# EAGLE schematic host (EAGLE 9.6.2)

## Sheet 1 of 4
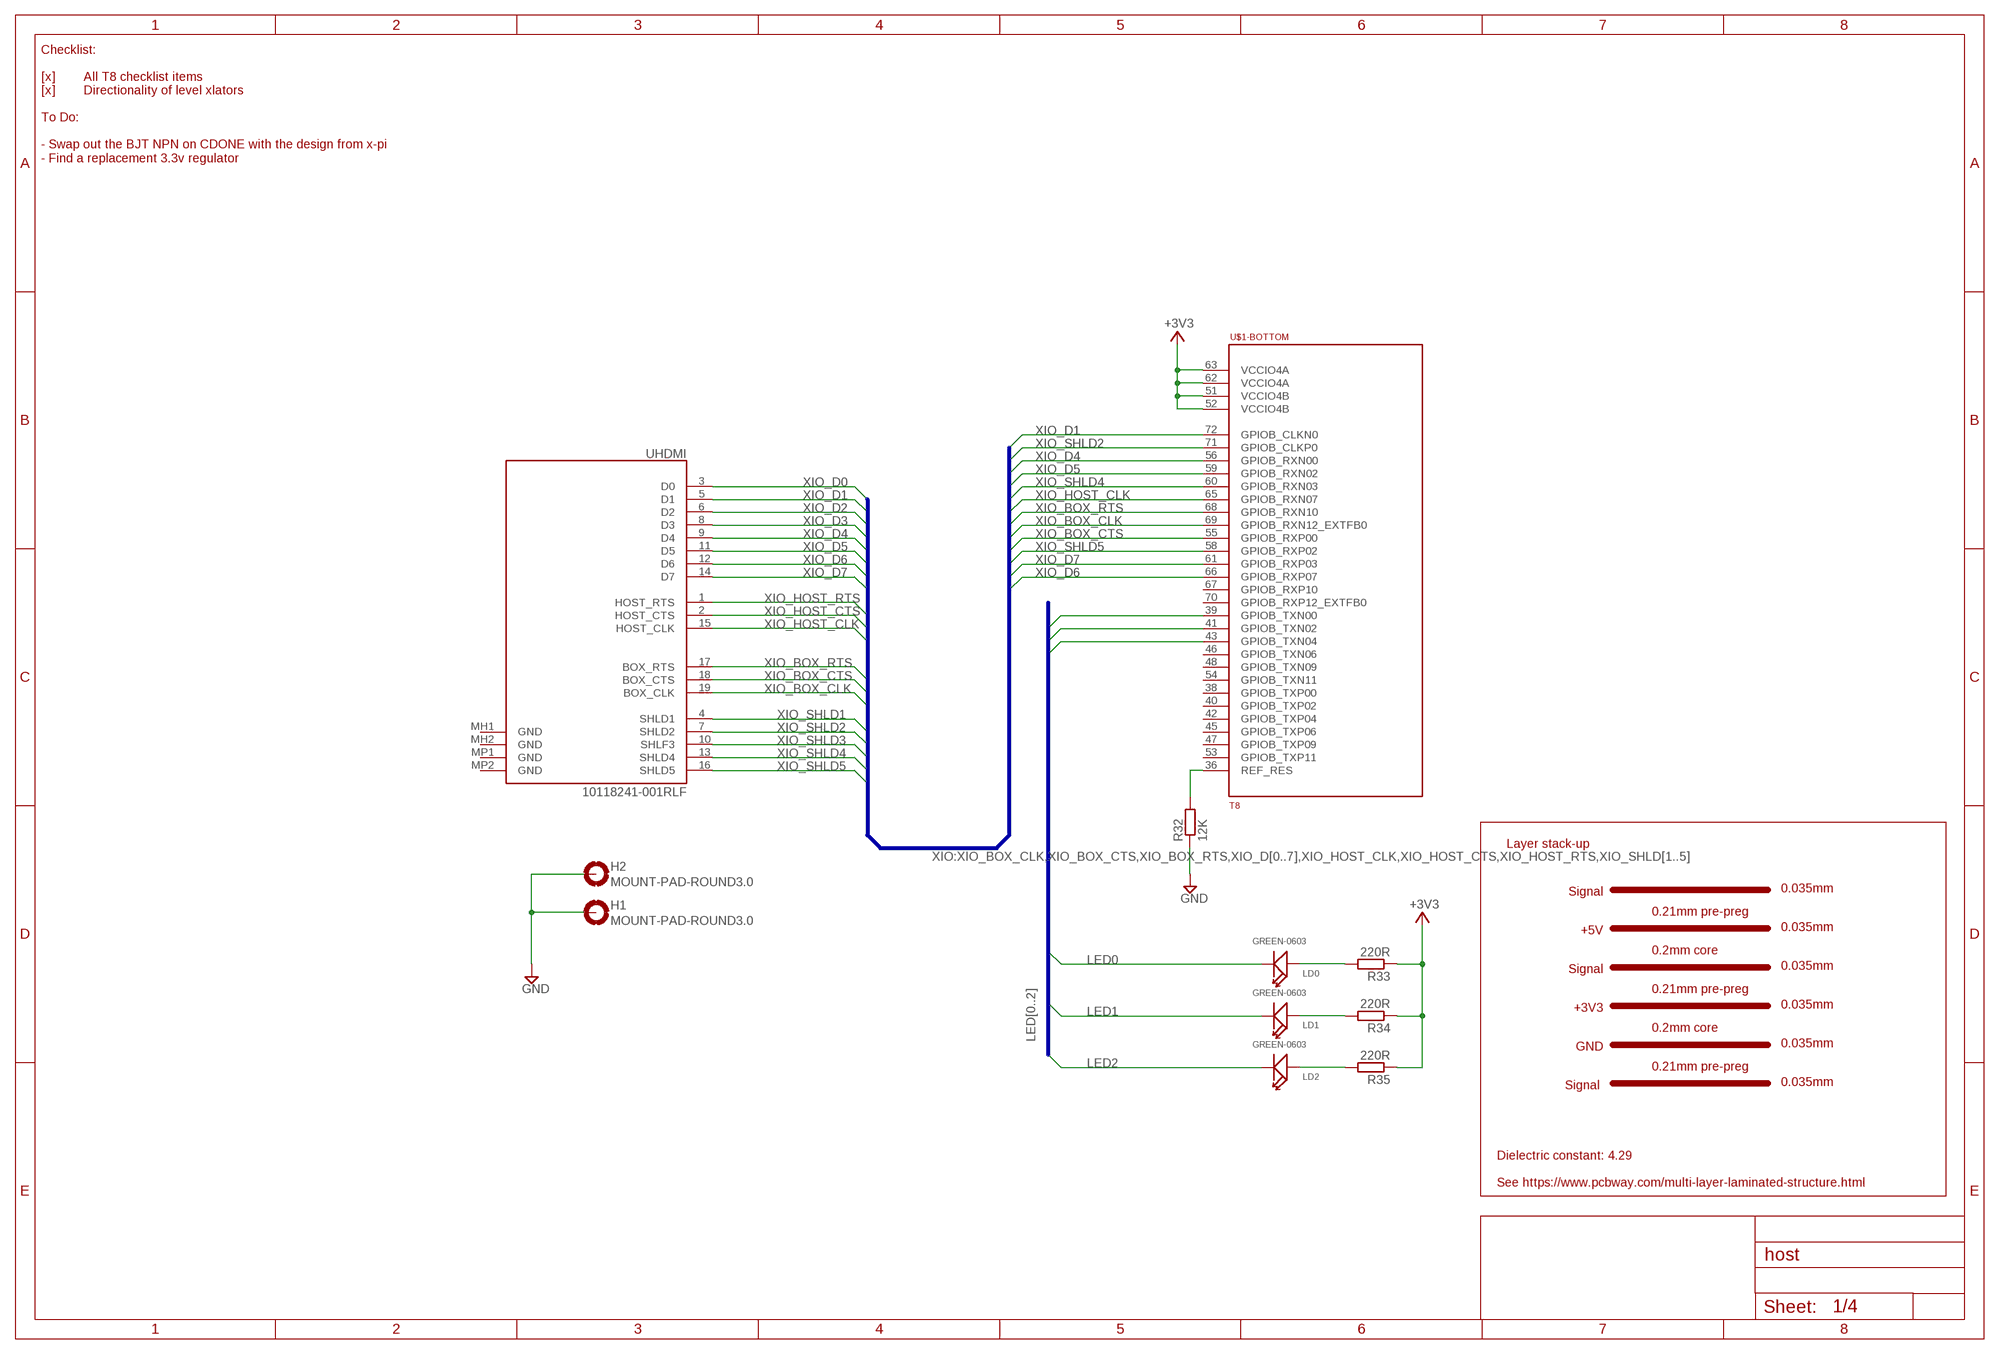
[diagram p0: schematic, sheet 1]

### Parts
H1  MOUNT-PAD-ROUND3.0  [3,0-PAD]
H2  MOUNT-PAD-ROUND3.0  [3,0-PAD]
LD0  GREEN-0603  SMD-LED-CLEAR-GREEN(0603)  [LED-0603]
LD1  GREEN-0603  SMD-LED-CLEAR-GREEN(0603)  [LED-0603]
LD2  GREEN-0603  SMD-LED-CLEAR-GREEN(0603)  [LED-0603]
R32  12K  R-EU_R0201  [R0201]
R33  220R  R-EU_R0201  [R0201]
R34  220R  R-EU_R0201  [R0201]
R35  220R  R-EU_R0201  [R0201]
U$1  T8  [TQFP144]
UHDMI  10118241-001RLF  [10118241001RLF]

### Nets
+3V3: R33.1 R34.1 R35.1 U$1.51(-BOTTOM:VCCIO4B) U$1.52(-BOTTOM:VCCIO4B) U$1.62(-BOTTOM:VCCIO4A) U$1.63(-BOTTOM:VCCIO4A) ; also sheet 2,3,4
GND: H1.B3,0(MOUNT) H2.B3,0(MOUNT) R32.1 ; also sheet 2,3,4
LED0: LD0.- U$1.39(-BOTTOM:GPIOB_TXN00)
LED1: LD1.- U$1.41(-BOTTOM:GPIOB_TXN02)
LED2: LD2.- U$1.43(-BOTTOM:GPIOB_TXN04)
N$8: R32.2 U$1.36(-BOTTOM:REF_RES)
N$13: LD0.+ R33.2
N$15: LD1.+ R34.2
N$16: LD2.+ R35.2
XIO_BOX_CLK: U$1.69(-BOTTOM:GPIOB_RXN12_EXTFB0) UHDMI.19(BOX_CLK) ; also sheet 4
XIO_BOX_CTS: U$1.55(-BOTTOM:GPIOB_RXP00) UHDMI.18(BOX_CTS) ; also sheet 4
XIO_BOX_RTS: U$1.68(-BOTTOM:GPIOB_RXN10) UHDMI.17(BOX_RTS) ; also sheet 4
XIO_D0: UHDMI.3(D0) ; also sheet 4
XIO_D1: U$1.72(-BOTTOM:GPIOB_CLKN0) UHDMI.5(D1) ; also sheet 4
XIO_D2: UHDMI.6(D2) ; also sheet 4
XIO_D3: UHDMI.8(D3) ; also sheet 4
XIO_D4: U$1.56(-BOTTOM:GPIOB_RXN00) UHDMI.9(D4) ; also sheet 4
XIO_D5: U$1.59(-BOTTOM:GPIOB_RXN02) UHDMI.11(D5) ; also sheet 4
XIO_D6: U$1.66(-BOTTOM:GPIOB_RXP07) UHDMI.12(D6) ; also sheet 4
XIO_D7: U$1.61(-BOTTOM:GPIOB_RXP03) UHDMI.14(D7) ; also sheet 4
XIO_HOST_CLK: U$1.65(-BOTTOM:GPIOB_RXN07) UHDMI.15(HOST_CLK) ; also sheet 4
XIO_HOST_CTS: UHDMI.2(HOST_CTS) ; also sheet 4
XIO_HOST_RTS: UHDMI.1(HOST_RTS) ; also sheet 4
XIO_SHLD1: UHDMI.4(SHLD1) ; also sheet 4
XIO_SHLD2: U$1.71(-BOTTOM:GPIOB_CLKP0) UHDMI.7(SHLD2) ; also sheet 4
XIO_SHLD3: UHDMI.10(SHLF3) ; also sheet 4
XIO_SHLD4: U$1.60(-BOTTOM:GPIOB_RXN03) UHDMI.13(SHLD4) ; also sheet 4
XIO_SHLD5: U$1.58(-BOTTOM:GPIOB_RXP02) UHDMI.16(SHLD5) ; also sheet 4
Unconnected: U$1.38(-BOTTOM:GPIOB_TXP00) U$1.40(-BOTTOM:GPIOB_TXP02) U$1.42(-BOTTOM:GPIOB_TXP04) U$1.45(-BOTTOM:GPIOB_TXP06) U$1.46(-BOTTOM:GPIOB_TXN06) U$1.47(-BOTTOM:GPIOB_TXP09) U$1.48(-BOTTOM:GPIOB_TXN09) U$1.53(-BOTTOM:GPIOB_TXP11) U$1.54(-BOTTOM:GPIOB_TXN11) U$1.67(-BOTTOM:GPIOB_RXP10) U$1.70(-BOTTOM:GPIOB_RXP12_EXTFB0) UHDMI.MH1(GND) UHDMI.MH2(GND) UHDMI.MP1(GND) UHDMI.MP2(GND)

### Buses
XIO:XIO_BOX_CLK,XIO_BOX_CTS,XIO_BOX_RTS,XIO_D[0..7],XIO_HOST_CLK,XIO_HOST_CTS,XIO_HOST_RTS,XIO_SHLD[1..5]
LED[0..2]

### Notes on the sheet
- Checklist:
  
  [x]        All T8 checklist items
  [x]        Directionality of level xlators
  
  To Do:
  
  - Swap out the BJT NPN on CDONE with the design from x-pi
  - Find a replacement 3.3v regulator
- Layer stack-up
- Signal
- 0.035mm
- 0.21mm pre-preg
- +5V
- 0.035mm
- 0.2mm core
- Signal
- 0.035mm
- 0.21mm pre-preg
- +3V3
- 0.035mm
- 0.2mm core
- GND
- 0.035mm
- 0.21mm pre-preg
- Signal
- 0.035mm
- Dielectric constant: 4.29
  
  See https://www.pcbway.com/multi-layer-laminated-structure.html

## Sheet 2 of 4: Power
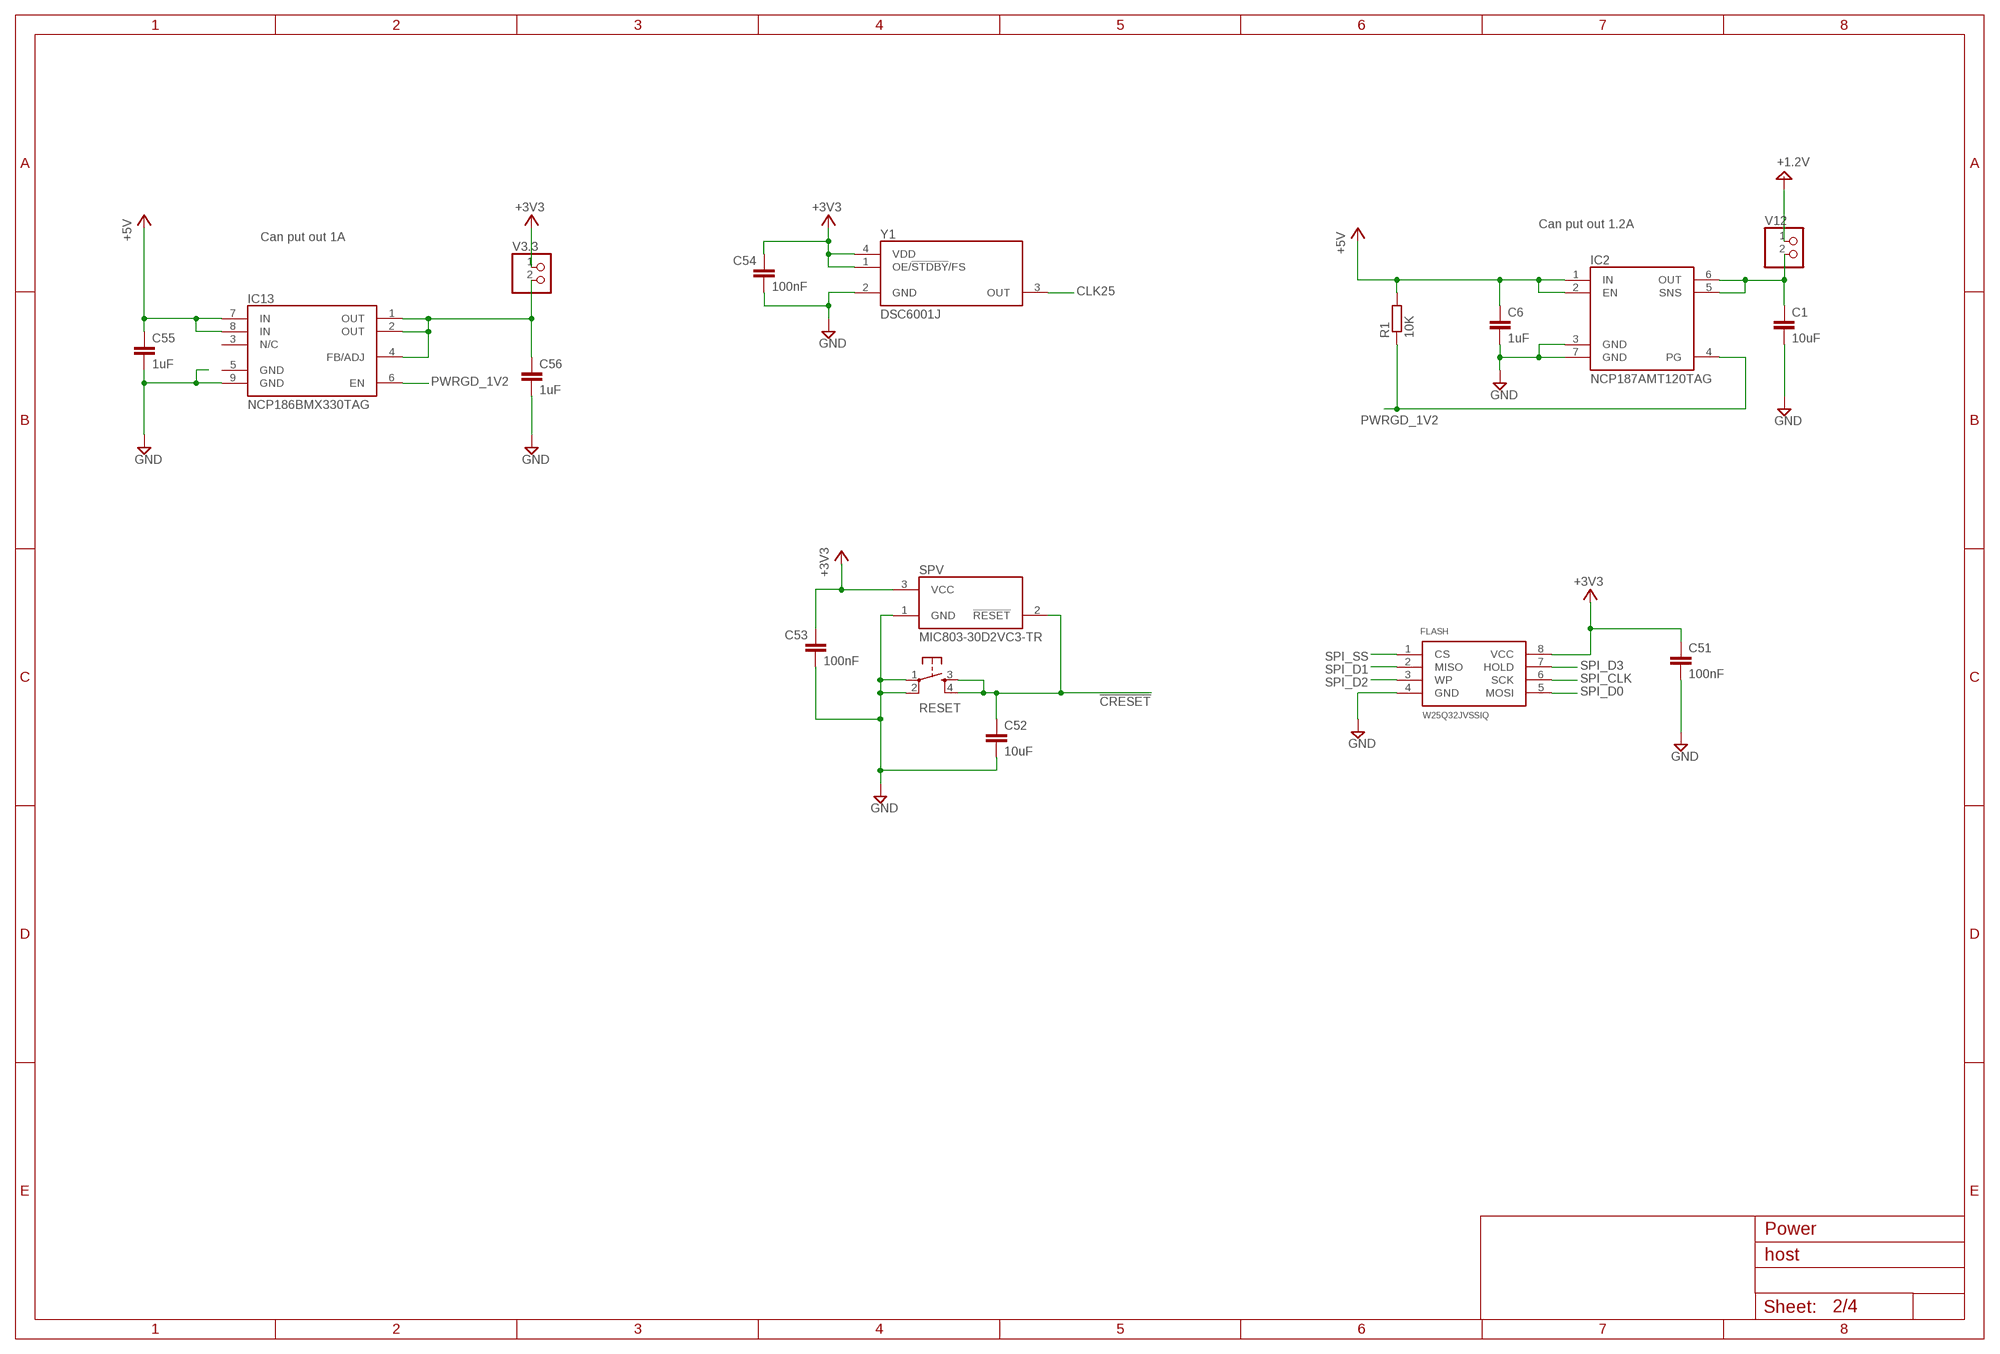
[diagram p1: schematic, sheet 2]

### Parts
C1  10uF  C-EUC0402K  [C0402K]
C6  1uF  C-EUC0201  [C0201]
C51  100nF  C-EUC0201  [C0201]
C52  10uF  C-EUC0402K  [C0402K]
C53  100nF  C-EUC0201  [C0201]
C54  100nF  C-EUC0201  [C0201]
C55  1uF  C-EUC0201  [C0201]
C56  1uF  C-EUC0201  [C0201]
FLASH  W25Q32JVSSIQ  SPI_FLASH-X25XXSMD  [SO08]
IC2  NCP187AMT120TAG  NCP187AMT330TAG  [SON65P200X200X80-7N]
IC13  NCP186BMX330TAG  [NCP186AMX330TAG]
R1  10K  R-EU_R0201  [R0201]
RESET  TAC_SWITCHPTH  [TACTILE-PTH]
SPV  MIC803-30D2VC3-TR  MIC803-30D2VM3-TR  [SOT95P237X111-3N]
V3.3  PINHD-1X2  [1X02]
V12  PINHD-1X2  [1X02]
Y1  DSC6001J  [DSC6001JE2B0240000]

### Nets
!CRESET!: C52.1 RESET.3 RESET.4 SPV.2(!RESET!) ; also sheet 3
+1.2V [+1.2v]: V12.1 ; also sheet 3,4
+3V3: C51.1 C53.1 C54.1 FLASH.8(VCC) SPV.3(VCC) V3.3.1 Y1.1(OE/!STDBY!/FS) Y1.4(VDD) ; also sheet 1,3,4
+5V: C6.1 C55.1 IC2.1(IN) IC2.2(EN) IC13.7(IN) IC13.8(IN) R1.2 ; also sheet 4
CLK25: Y1.3(OUT) ; also sheet 4
GND: C1.2 C6.2 C51.2 C52.2 C53.2 C54.2 C55.2 C56.2 FLASH.4(GND) IC2.3(GND) IC2.7(GND) IC13.9(GND) RESET.1 RESET.2 SPV.1(GND) Y1.2(GND) ; also sheet 1,3,4
N$2: C1.1 IC2.5(SNS) IC2.6(OUT) V12.2
N$18: C56.1 IC13.1(OUT) IC13.2(OUT) IC13.4(FB/ADJ) V3.3.2
PWRGD_1V2: IC2.4(PG) IC13.6(EN) R1.1
SPI_CLK: FLASH.6(SCK) ; also sheet 3
SPI_D0: FLASH.5(MOSI) ; also sheet 3
SPI_D1: FLASH.2(MISO) ; also sheet 3
SPI_D2: FLASH.3(WP) ; also sheet 4
SPI_D3: FLASH.7(HOLD) ; also sheet 3,4
SPI_SS: FLASH.1(CS) ; also sheet 3
Unconnected: IC13.3(N/C) IC13.5(GND)

### Notes on the sheet
- Can put out 1.2A
- Can put out 1A
- Power

## Sheet 3 of 4: FPGA
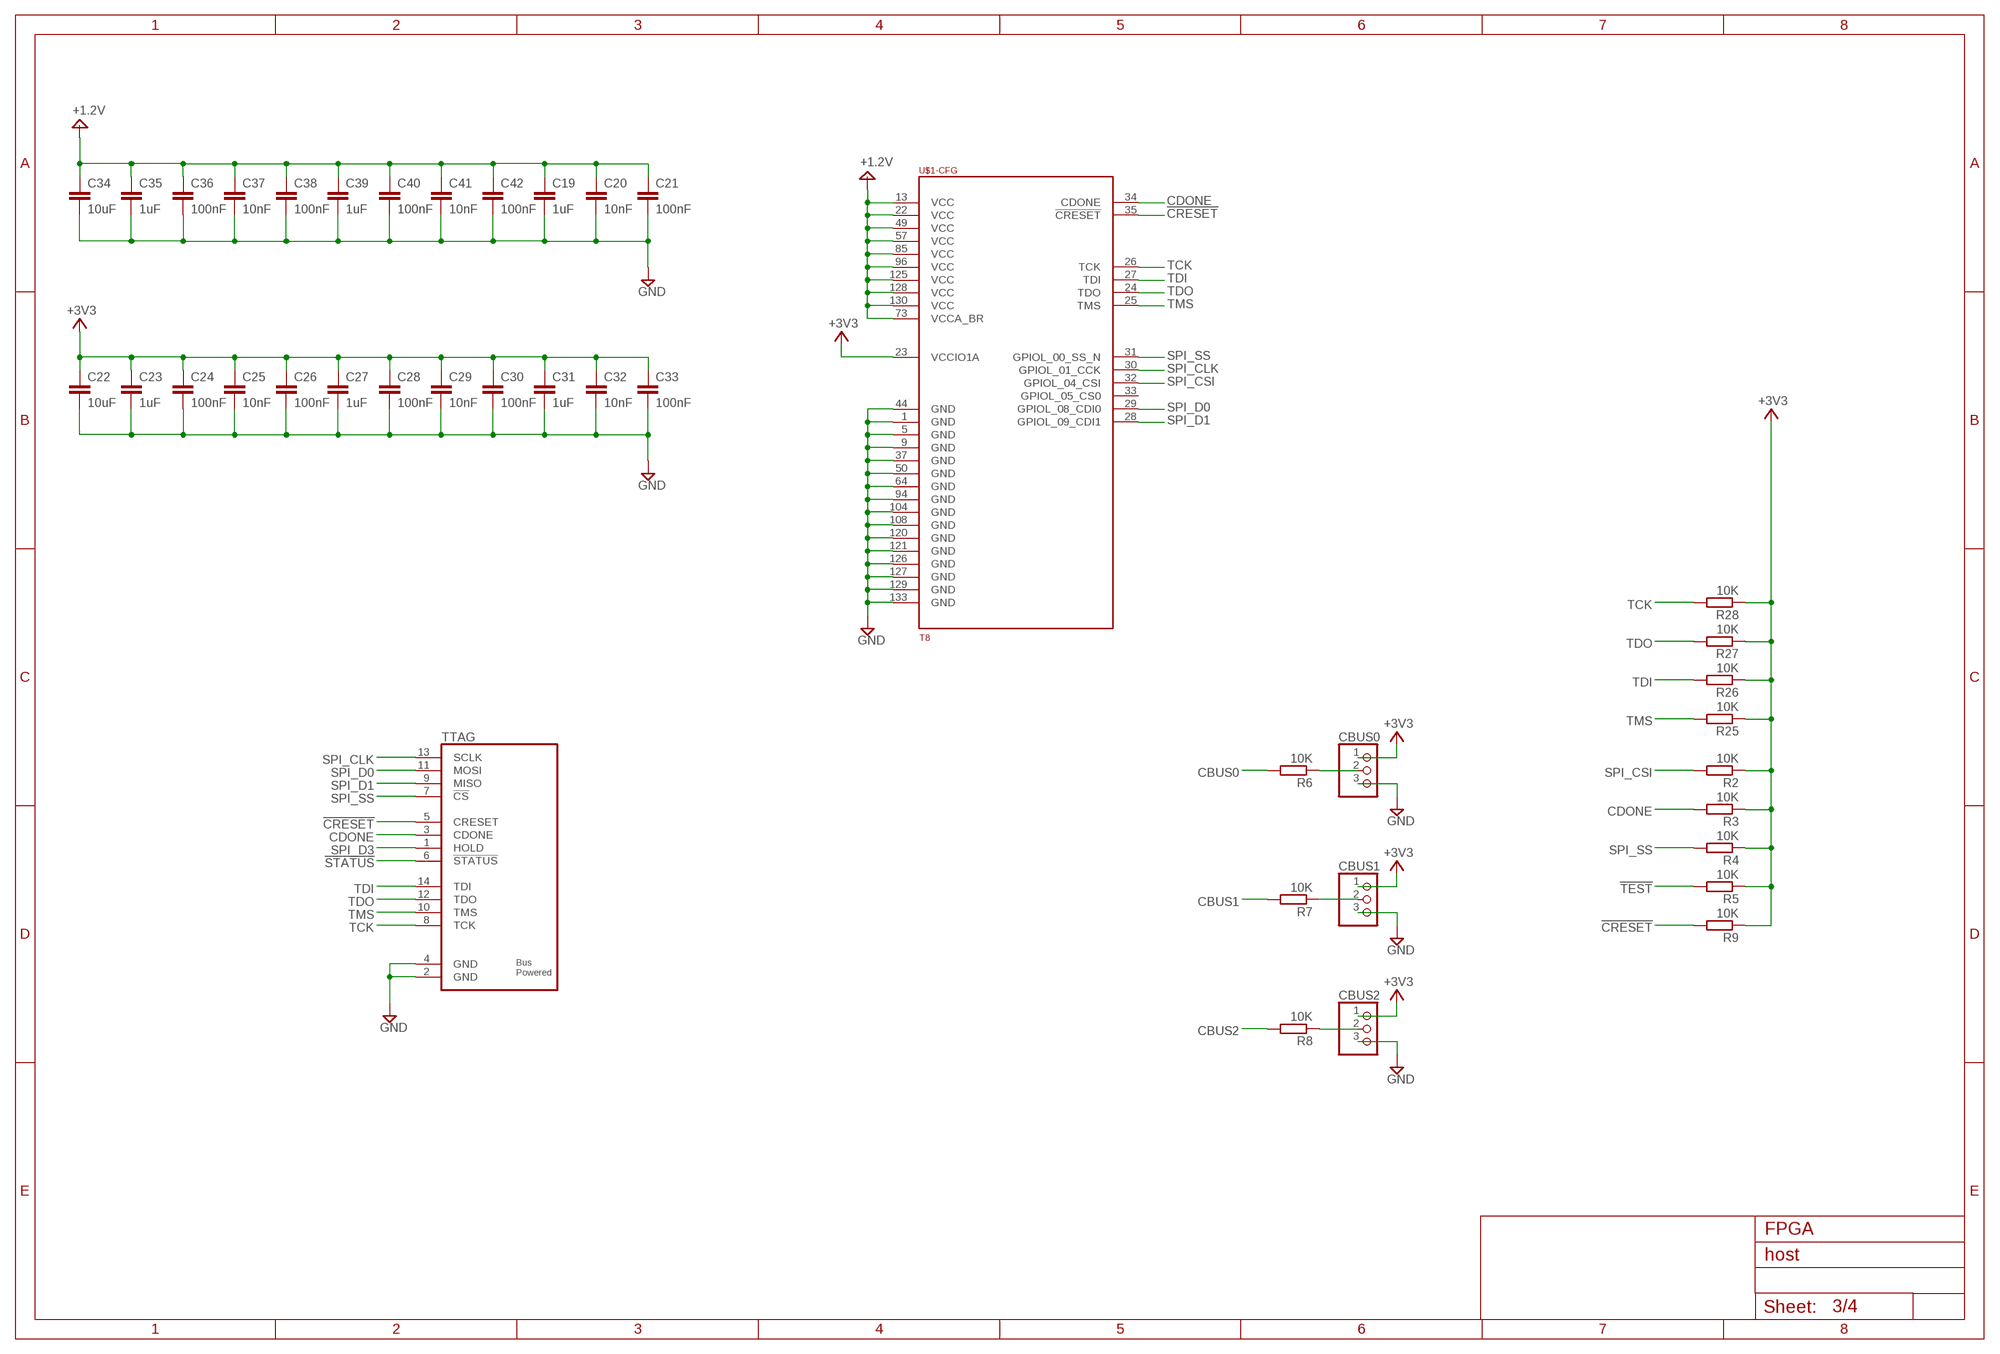
[diagram p2: schematic, sheet 3]

### Parts
C19  1uF  C-EUC0201  [C0201]
C20  10nF  C-EUC0201  [C0201]
C21  100nF  C-EUC0201  [C0201]
C22  10uF  C-EUC0402K  [C0402K]
C23  1uF  C-EUC0201  [C0201]
C24  100nF  C-EUC0201  [C0201]
C25  10nF  C-EUC0201  [C0201]
C26  100nF  C-EUC0201  [C0201]
C27  1uF  C-EUC0201  [C0201]
C28  100nF  C-EUC0201  [C0201]
C29  10nF  C-EUC0201  [C0201]
C30  100nF  C-EUC0201  [C0201]
C31  1uF  C-EUC0201  [C0201]
C32  10nF  C-EUC0201  [C0201]
C33  100nF  C-EUC0201  [C0201]
C34  10uF  C-EUC0402K  [C0402K]
C35  1uF  C-EUC0201  [C0201]
C36  100nF  C-EUC0201  [C0201]
C37  10nF  C-EUC0201  [C0201]
C38  100nF  C-EUC0201  [C0201]
C39  1uF  C-EUC0201  [C0201]
C40  100nF  C-EUC0201  [C0201]
C41  10nF  C-EUC0201  [C0201]
C42  100nF  C-EUC0201  [C0201]
CBUS0  PINHD-1X3  [1X03]
CBUS1  PINHD-1X3  [1X03]
CBUS2  PINHD-1X3  [1X03]
R2  10K  R-EU_R0201  [R0201]
R3  10K  R-EU_R0201  [R0201]
R4  10K  R-EU_R0201  [R0201]
R5  10K  R-EU_R0201  [R0201]
R6  10K  R-EU_R0201  [R0201]
R7  10K  R-EU_R0201  [R0201]
R8  10K  R-EU_R0201  [R0201]
R9  10K  R-EU_R0201  [R0201]
R25  10K  R-EU_R0201  [R0201]
R26  10K  R-EU_R0201  [R0201]
R27  10K  R-EU_R0201  [R0201]
R28  10K  R-EU_R0201  [R0201]
TTAG  TTAG_M_2.00  [2X07M]

### Nets
!CRESET!: R9.2 TTAG.5(CRESET) U$1.35(-CFG:!CRESET!) ; also sheet 2
!STATUS!: TTAG.6(!STATUS!) ; also sheet 4
!TEST!: R5.2 ; also sheet 4
+1.2V [+1.2v]: C19.1 C20.1 C21.1 C34.1 C35.1 C36.1 C37.1 C38.1 C39.1 C40.1 C41.1 C42.1 U$1.13(-CFG:VCC) U$1.22(-CFG:VCC) U$1.49(-CFG:VCC) U$1.57(-CFG:VCC) U$1.73(-CFG:VCCA_BR) U$1.85(-CFG:VCC) U$1.96(-CFG:VCC) U$1.125(-CFG:VCC) U$1.128(-CFG:VCC) U$1.130(-CFG:VCC) ; also sheet 2,4
+3V3: C22.1 C23.1 C24.1 C25.1 C26.1 C27.1 C28.1 C29.1 C30.1 C31.1 C32.1 C33.1 CBUS0.1 CBUS1.1 CBUS2.1 R2.1 R3.1 R4.1 R5.1 R9.1 R25.1 R26.1 R27.1 R28.1 U$1.23(-CFG:VCCIO1A) ; also sheet 1,2,4
CBUS0: R6.2 ; also sheet 4
CBUS1: R7.2 ; also sheet 4
CBUS2: R8.2 ; also sheet 4
CDONE: R3.2 TTAG.3(CDONE) U$1.34(-CFG:CDONE) ; also sheet 4
GND: C19.2 C20.2 C21.2 C22.2 C23.2 C24.2 C25.2 C26.2 C27.2 C28.2 C29.2 C30.2 C31.2 C32.2 C33.2 C34.2 C35.2 C36.2 C37.2 C38.2 C39.2 C40.2 C41.2 C42.2 CBUS0.3 CBUS1.3 CBUS2.3 TTAG.2(GND) TTAG.4(GND) U$1.1(-CFG:GND) U$1.5(-CFG:GND) U$1.9(-CFG:GND) U$1.37(-CFG:GND) U$1.44(-CFG:GND) U$1.50(-CFG:GND) U$1.64(-CFG:GND) U$1.94(-CFG:GND) U$1.104(-CFG:GND) U$1.108(-CFG:GND) U$1.120(-CFG:GND) U$1.121(-CFG:GND) U$1.126(-CFG:GND) U$1.127(-CFG:GND) U$1.129(-CFG:GND) U$1.133(-CFG:GND) ; also sheet 1,2,4
N$10: CBUS0.2 R6.1
N$11: CBUS1.2 R7.1
N$12: CBUS2.2 R8.1
SPI_CLK: TTAG.13(SCLK) U$1.30(-CFG:GPIOL_01_CCK) ; also sheet 2
SPI_CSI: R2.2 U$1.32(-CFG:GPIOL_04_CSI)
SPI_D0: TTAG.11(MOSI) U$1.29(-CFG:GPIOL_08_CDI0) ; also sheet 2
SPI_D1: TTAG.9(MISO) U$1.28(-CFG:GPIOL_09_CDI1) ; also sheet 2
SPI_D3: TTAG.1(HOLD) ; also sheet 2,4
SPI_SS: R4.2 TTAG.7(!CS!) U$1.31(-CFG:GPIOL_00_SS_N) ; also sheet 2
TCK: R28.2 TTAG.8(TCK) U$1.26(-CFG:TCK)
TDI: R26.2 TTAG.14(TDI) U$1.27(-CFG:TDI)
TDO: R27.2 TTAG.12(TDO) U$1.24(-CFG:TDO)
TMS: R25.2 TTAG.10(TMS) U$1.25(-CFG:TMS)
Unconnected: U$1.33(-CFG:GPIOL_05_CS0)

### Notes on the sheet
- FPGA

## Sheet 4 of 4
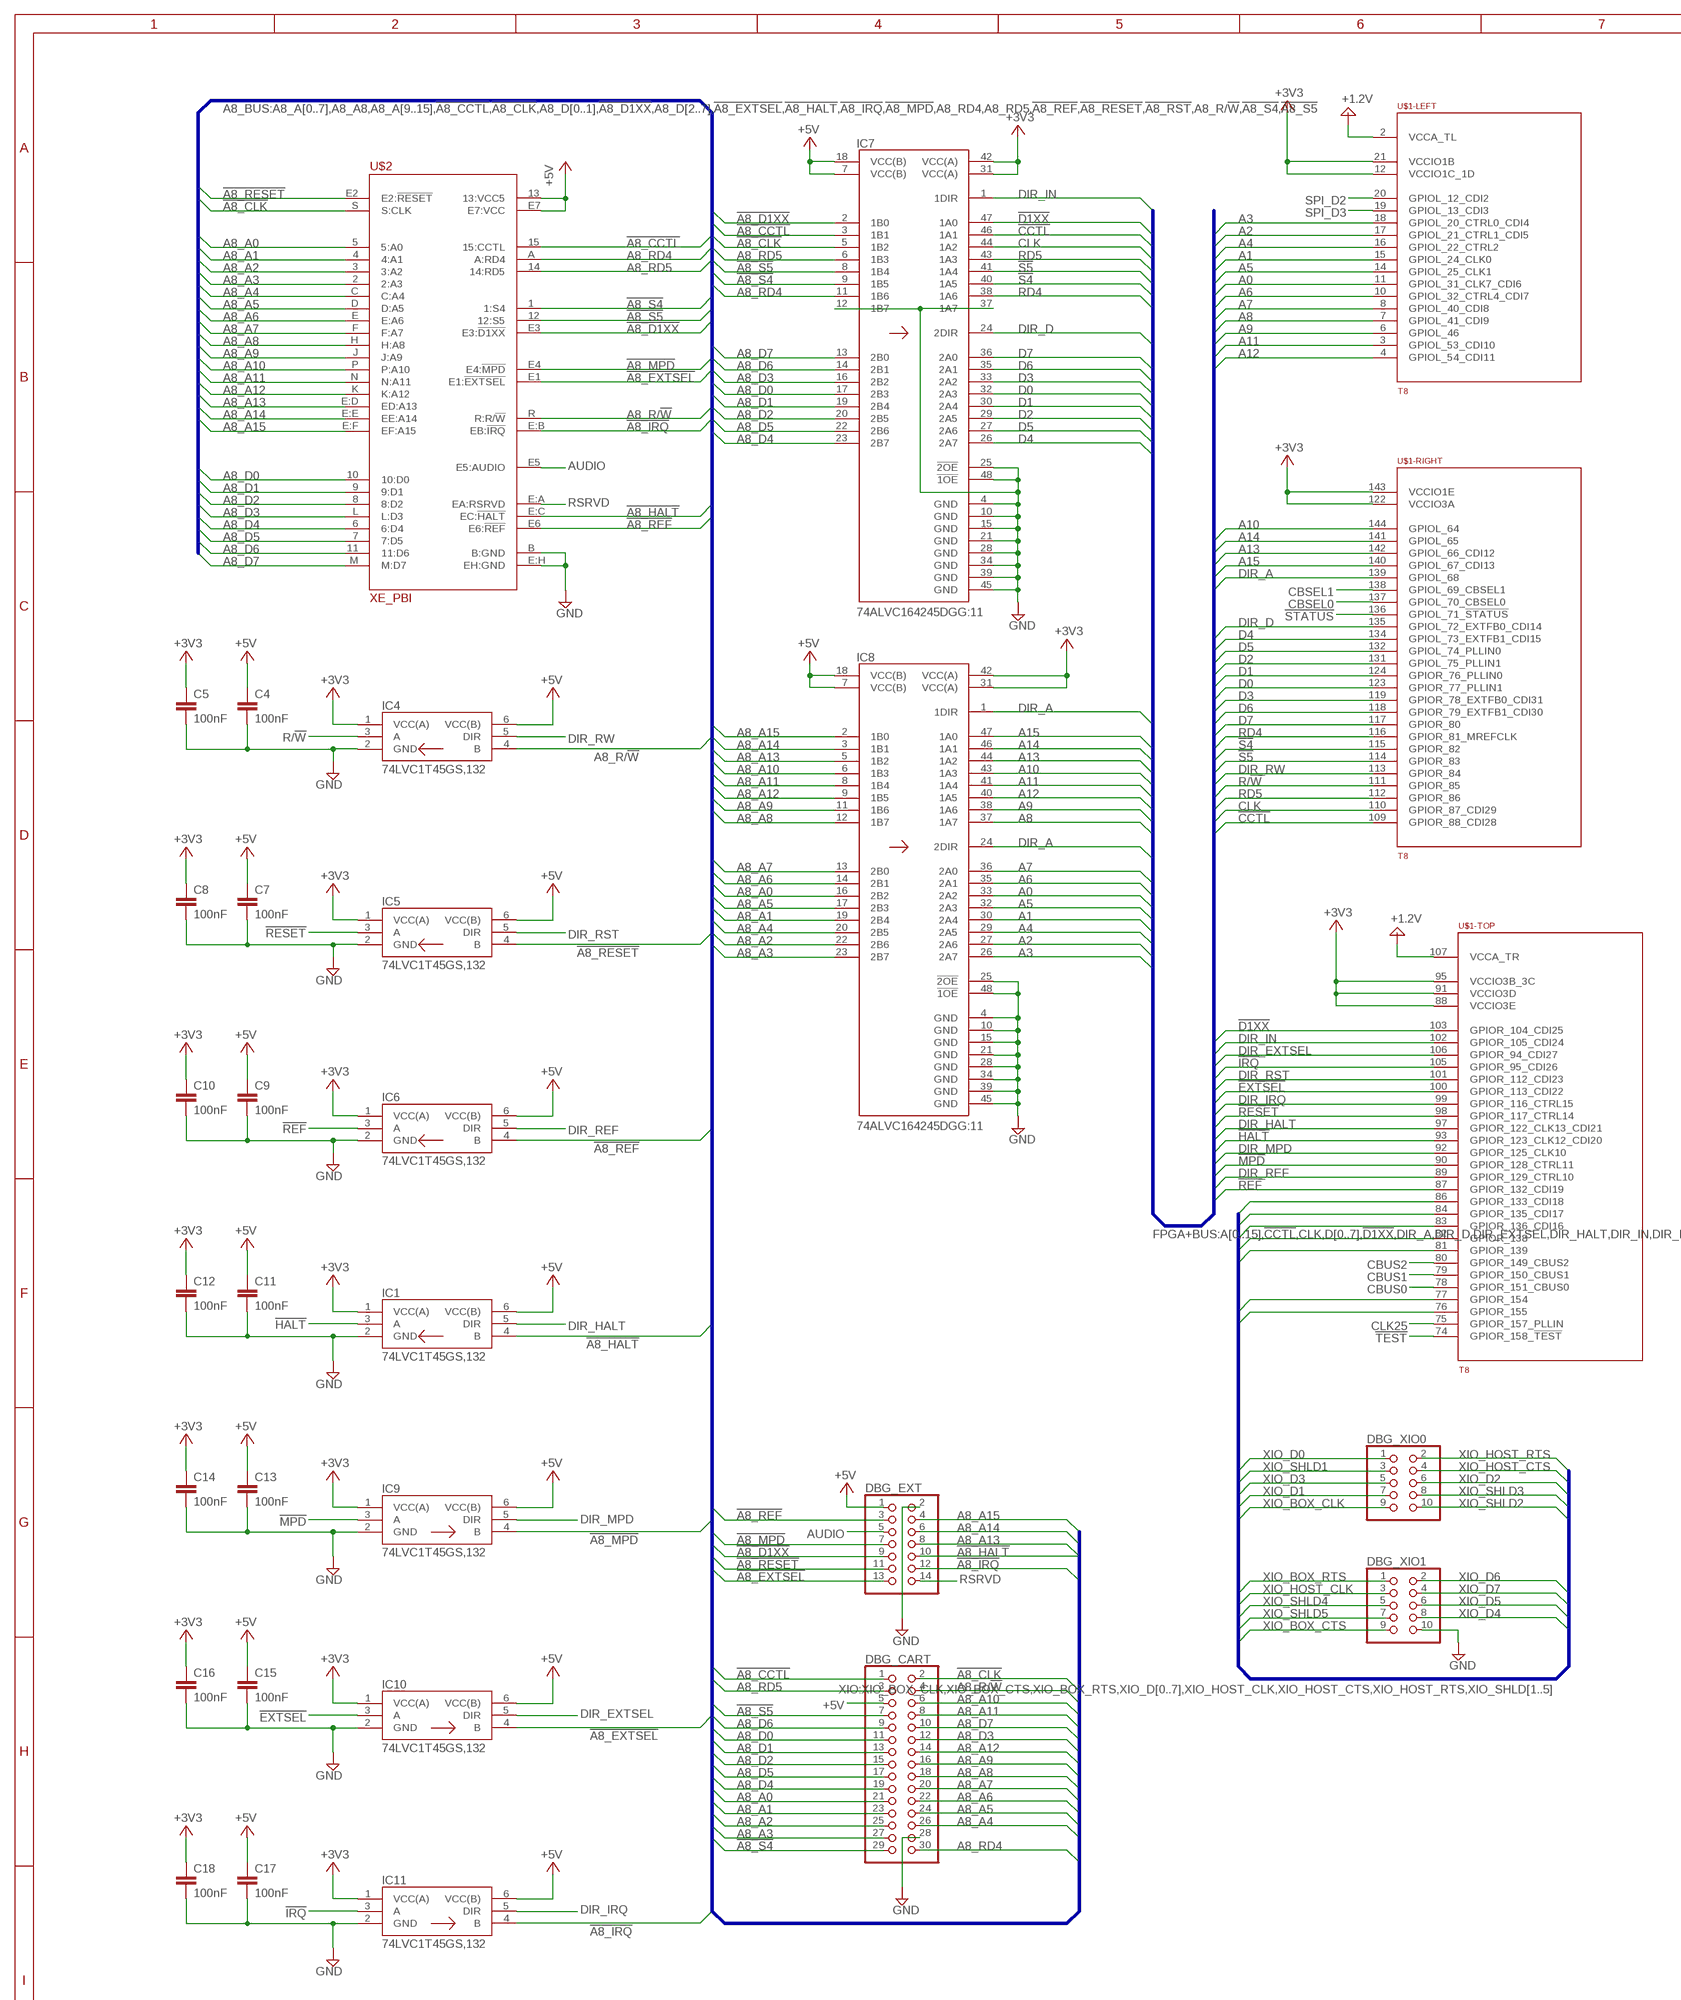
[diagram p3: schematic, sheet 4, part 1 of 2]
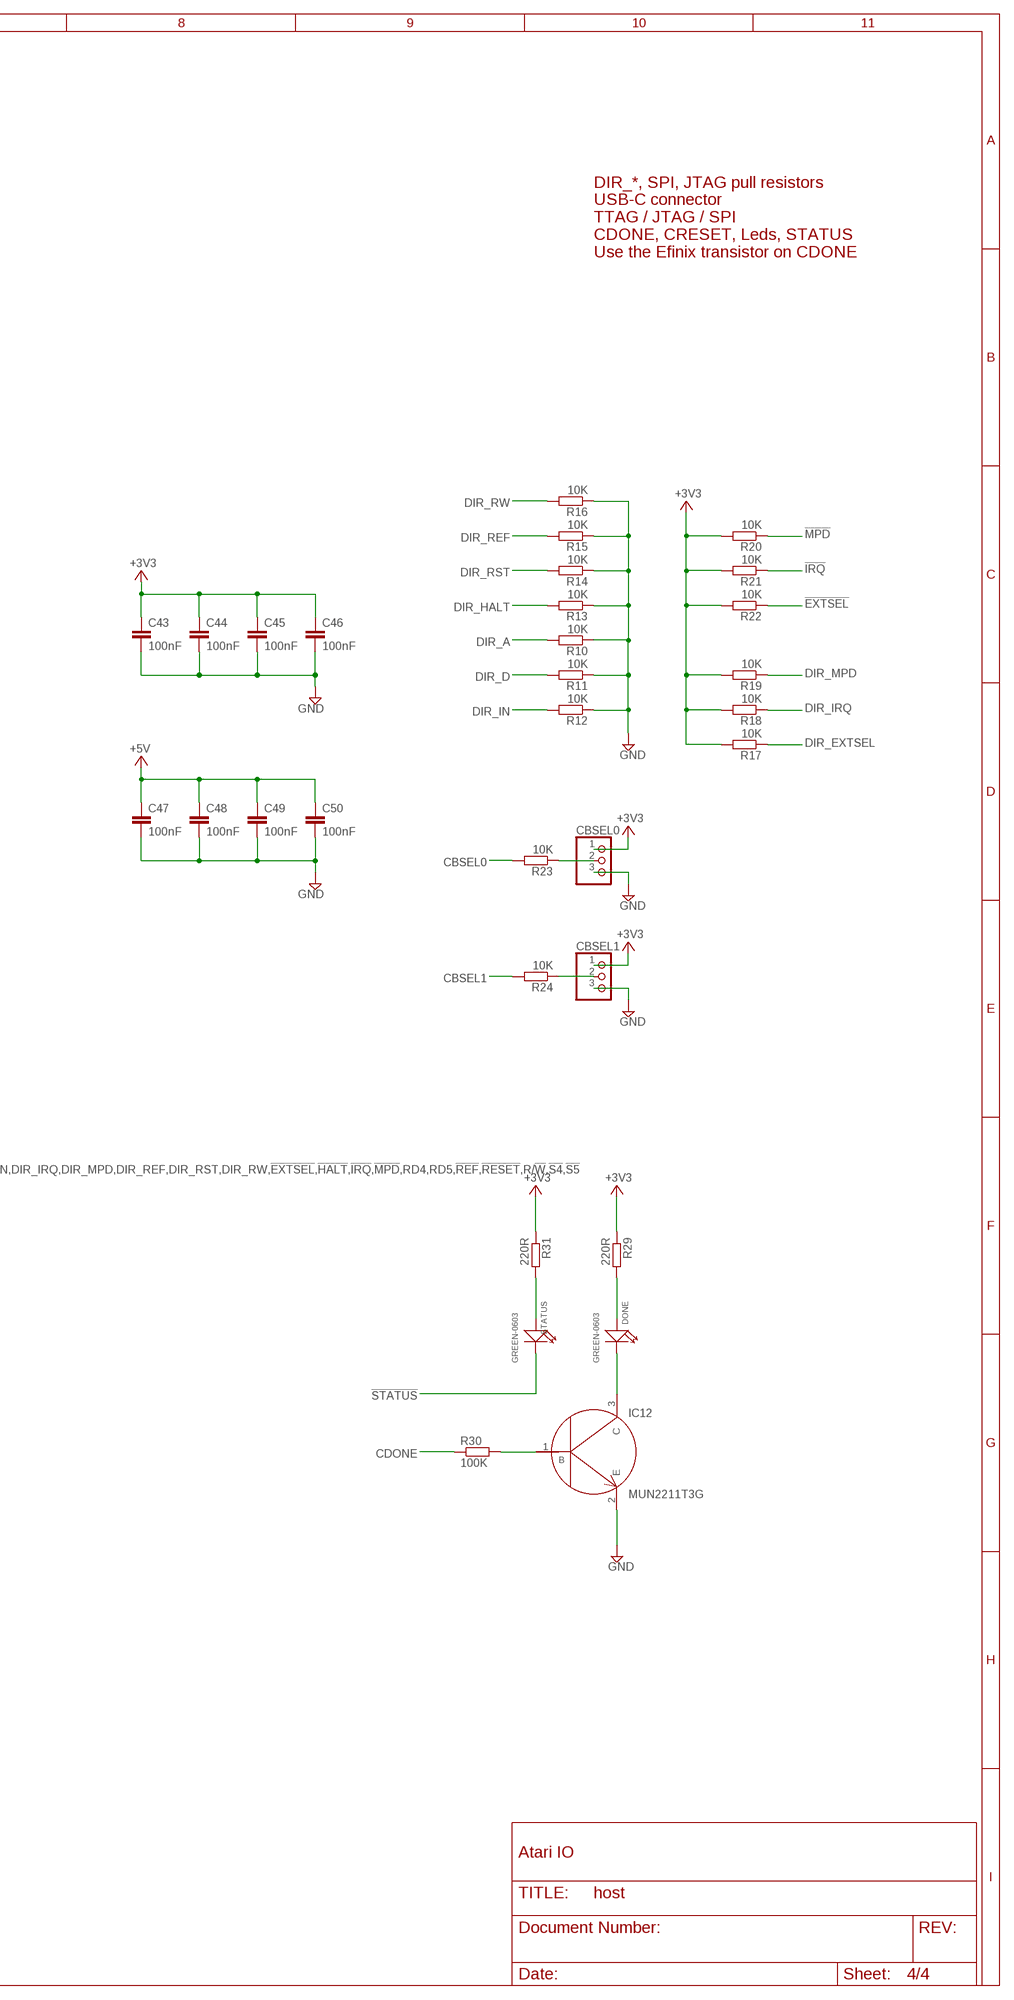
[diagram p4: schematic, sheet 4, part 2 of 2]

### Parts
C4  100nF  C-EUC0201  [C0201]
C5  100nF  C-EUC0201  [C0201]
C7  100nF  C-EUC0201  [C0201]
C8  100nF  C-EUC0201  [C0201]
C9  100nF  C-EUC0201  [C0201]
C10  100nF  C-EUC0201  [C0201]
C11  100nF  C-EUC0201  [C0201]
C12  100nF  C-EUC0201  [C0201]
C13  100nF  C-EUC0201  [C0201]
C14  100nF  C-EUC0201  [C0201]
C15  100nF  C-EUC0201  [C0201]
C16  100nF  C-EUC0201  [C0201]
C17  100nF  C-EUC0201  [C0201]
C18  100nF  C-EUC0201  [C0201]
C43  100nF  C-EUC0201  [C0201]
C44  100nF  C-EUC0201  [C0201]
C45  100nF  C-EUC0201  [C0201]
C46  100nF  C-EUC0201  [C0201]
C47  100nF  C-EUC0201  [C0201]
C48  100nF  C-EUC0201  [C0201]
C49  100nF  C-EUC0201  [C0201]
C50  100nF  C-EUC0201  [C0201]
CBSEL0  PINHD-1X3  [1X03]
CBSEL1  PINHD-1X3  [1X03]
DBG_CART  PINHD-2X15_2.54  [2X15]
DBG_EXT  PINHD-2X07_2.54  [2X07]
DBG_XIO0  PINHD-2X5  [2X05]
DBG_XIO1  PINHD-2X5  [2X05]
DONE  GREEN-0603  SMD-LED-CLEAR-GREEN(0603)  [LED-0603]
IC1  74LVC1T45GS,132  [74LVC1G3157GS132]
IC4  74LVC1T45GS,132  [74LVC1G3157GS132]
IC5  74LVC1T45GS,132  [74LVC1G3157GS132]
IC6  74LVC1T45GS,132  [74LVC1G3157GS132]
IC7  74ALVC164245DGG:11  74ALVC164245DGG_11  [SOP50P810X120-48N]
IC8  74ALVC164245DGG:11  74ALVC164245DGG_11  [SOP50P810X120-48N]
IC9  74LVC1T45GS,132  [74LVC1G3157GS132]
IC10  74LVC1T45GS,132  [74LVC1G3157GS132]
IC11  74LVC1T45GS,132  [74LVC1G3157GS132]
IC12  MUN2211T3G  MMBT3904T  [SOTFL50P160X78-3N]
R10  10K  R-EU_R0201  [R0201]
R11  10K  R-EU_R0201  [R0201]
R12  10K  R-EU_R0201  [R0201]
R13  10K  R-EU_R0201  [R0201]
R14  10K  R-EU_R0201  [R0201]
R15  10K  R-EU_R0201  [R0201]
R16  10K  R-EU_R0201  [R0201]
R17  10K  R-EU_R0201  [R0201]
R18  10K  R-EU_R0201  [R0201]
R19  10K  R-EU_R0201  [R0201]
R20  10K  R-EU_R0201  [R0201]
R21  10K  R-EU_R0201  [R0201]
R22  10K  R-EU_R0201  [R0201]
R23  10K  R-EU_R0201  [R0201]
R24  10K  R-EU_R0201  [R0201]
R29  220R  R-EU_R0201  [R0201]
R30  100K  R-EU_R0201  [R0201]
R31  220R  R-EU_R0201  [R0201]
STATUS  GREEN-0603  SMD-LED-CLEAR-GREEN(0603)  [LED-0603]
U$2  XE_PBI  [XE_PBI]

### Nets
!A8_CCTL!: DBG_CART.1 IC7.3(1B1) U$2.15(15:CCTL)
!A8_CLK!: DBG_CART.2 IC7.5(1B2) U$2.S(S:CLK)
!A8_D1XX!: DBG_EXT.9 IC7.2(1B0) U$2.E3(E3:!D1XX!)
!A8_EXTSEL!: DBG_EXT.13 IC10.4(B) U$2.E1(E1:!EXTSEL!)
!A8_HALT!: DBG_EXT.10 IC1.4(B) U$2.E:C(EC:!HALT!)
!A8_IRQ!: DBG_EXT.12 IC11.4(B) U$2.E:B(EB:!IRQ!)
!A8_MPD!: DBG_EXT.7 IC9.4(B) U$2.E4(E4:!MPD!)
!A8_REF!: DBG_EXT.3 IC6.4(B) U$2.E6(E6:!REF!)
!A8_RESET!: DBG_EXT.11 IC5.4(B) U$2.E2(E2:!RESET!)
!A8_S4!: DBG_CART.29 IC7.9(1B5) U$2.1(1:S4)
!A8_S5!: DBG_CART.7 IC7.8(1B4) U$2.12(12:S5)
!CCTL!: IC7.46(1A1) U$1.109(-RIGHT:GPIOR_88_CDI28)
!D1XX!: IC7.47(1A0) U$1.103(-TOP:GPIOR_104_CDI25)
!EXTSEL!: IC10.3(A) R22.1 U$1.100(-TOP:GPIOR_113_CDI22)
!HALT!: IC1.3(A) U$1.93(-TOP:GPIOR_123_CLK12_CDI20)
!IRQ!: IC11.3(A) R21.1 U$1.105(-TOP:GPIOR_95_CDI26)
!MPD!: IC9.3(A) R20.1 U$1.90(-TOP:GPIOR_128_CTRL11)
!REF!: IC6.3(A) U$1.87(-TOP:GPIOR_132_CDI19)
!RESET!: IC5.3(A) U$1.98(-TOP:GPIOR_117_CTRL14)
!S4!: IC7.40(1A5) U$1.115(-RIGHT:GPIOR_82)
!S5!: IC7.41(1A4) U$1.114(-RIGHT:GPIOR_83)
!STATUS!: STATUS.- U$1.136(-RIGHT:GPIOL_71_!STATUS!) ; also sheet 3
!TEST!: U$1.74(-TOP:GPIOR_158_!TEST!) ; also sheet 3
+1.2V [+1.2v]: U$1.2(-LEFT:VCCA_TL) U$1.107(-TOP:VCCA_TR) ; also sheet 2,3
+3V3: C5.1 C8.1 C10.1 C12.1 C14.1 C16.1 C18.1 C43.1 C44.1 C45.1 C46.1 CBSEL0.1 CBSEL1.1 IC1.1(VCC(A)) IC4.1(VCC(A)) IC5.1(VCC(A)) IC6.1(VCC(A)) IC7.31(VCC(A)) IC7.42(VCC(A)) IC8.31(VCC(A)) IC8.42(VCC(A)) IC9.1(VCC(A)) IC10.1(VCC(A)) IC11.1(VCC(A)) R17.2 R18.2 R19.2 R20.2 R21.2 R22.2 R29.1 R31.1 U$1.12(-LEFT:VCCIO1C_1D) U$1.21(-LEFT:VCCIO1B) U$1.88(-TOP:VCCIO3E) U$1.91(-TOP:VCCIO3D) U$1.95(-TOP:VCCIO3B_3C) U$1.122(-RIGHT:VCCIO3A) U$1.143(-RIGHT:VCCIO1E) ; also sheet 1,2,3
+5V: C4.1 C7.1 C9.1 C11.1 C13.1 C15.1 C17.1 C47.1 C48.1 C49.1 C50.1 DBG_CART.5 DBG_EXT.1 IC1.6(VCC(B)) IC4.6(VCC(B)) IC5.6(VCC(B)) IC6.6(VCC(B)) IC7.7(VCC(B)) IC7.18(VCC(B)) IC8.7(VCC(B)) IC8.18(VCC(B)) IC9.6(VCC(B)) IC10.6(VCC(B)) IC11.6(VCC(B)) U$2.13(13:VCC5) U$2.E7(E7:VCC) ; also sheet 2
A0: IC8.33(2A2) U$1.11(-LEFT:GPIOL_31_CLK7_CDI6)
A1: IC8.30(2A4) U$1.15(-LEFT:GPIOL_24_CLK0)
A2: IC8.27(2A6) U$1.17(-LEFT:GPIOL_21_CTRL1_CDI5)
A3: IC8.26(2A7) U$1.18(-LEFT:GPIOL_20_CTRL0_CDI4)
A4: IC8.29(2A5) U$1.16(-LEFT:GPIOL_22_CTRL2)
A5: IC8.32(2A3) U$1.14(-LEFT:GPIOL_25_CLK1)
A6: IC8.35(2A1) U$1.10(-LEFT:GPIOL_32_CTRL4_CDI7)
A7: IC8.36(2A0) U$1.8(-LEFT:GPIOL_40_CDI8)
A8: IC8.37(1A7) U$1.7(-LEFT:GPIOL_41_CDI9)
A8_A0: DBG_CART.21 IC8.16(2B2) U$2.5(5:A0)
A8_A1: DBG_CART.23 IC8.19(2B4) U$2.4(4:A1)
A8_A2: DBG_CART.25 IC8.22(2B6) U$2.3(3:A2)
A8_A3: DBG_CART.27 IC8.23(2B7) U$2.2(2:A3)
A8_A4: DBG_CART.26 IC8.20(2B5) U$2.C(C:A4)
A8_A5: DBG_CART.24 IC8.17(2B3) U$2.D(D:A5)
A8_A6: DBG_CART.22 IC8.14(2B1) U$2.E(E:A6)
A8_A7: DBG_CART.20 IC8.13(2B0) U$2.F(F:A7)
A8_A8: DBG_CART.18 IC8.12(1B7) U$2.H(H:A8)
A8_A9: DBG_CART.16 IC8.11(1B6) U$2.J(J:A9)
A8_A10: DBG_CART.6 IC8.6(1B3) U$2.P(P:A10)
A8_A11: DBG_CART.8 IC8.8(1B4) U$2.N(N:A11)
A8_A12: DBG_CART.14 IC8.9(1B5) U$2.K(K:A12)
A8_A13: DBG_EXT.8 IC8.5(1B2) U$2.E:D(ED:A13)
A8_A14: DBG_EXT.6 IC8.3(1B1) U$2.E:E(EE:A14)
A8_A15: DBG_EXT.4 IC8.2(1B0) U$2.E:F(EF:A15)
A8_D0: DBG_CART.11 IC7.17(2B3) U$2.10(10:D0)
A8_D1: DBG_CART.13 IC7.19(2B4) U$2.9(9:D1)
A8_D2: DBG_CART.15 IC7.20(2B5) U$2.8(8:D2)
A8_D3: DBG_CART.12 IC7.16(2B2) U$2.L(L:D3)
A8_D4: DBG_CART.19 IC7.23(2B7) U$2.6(6:D4)
A8_D5: DBG_CART.17 IC7.22(2B6) U$2.7(7:D5)
A8_D6: DBG_CART.9 IC7.14(2B1) U$2.11(11:D6)
A8_D7: DBG_CART.10 IC7.13(2B0) U$2.M(M:D7)
A8_R/!W!: DBG_CART.4 IC4.4(B) U$2.R(R:R/!W!)
A8_RD4: DBG_CART.30 IC7.11(1B6) U$2.A(A:RD4)
A8_RD5: DBG_CART.3 IC7.6(1B3) U$2.14(14:RD5)
A9: IC8.38(1A6) U$1.6(-LEFT:GPIOL_46)
A10: IC8.43(1A3) U$1.144(-RIGHT:GPIOL_64)
A11: IC8.41(1A4) U$1.3(-LEFT:GPIOL_53_CDI10)
A12: IC8.40(1A5) U$1.4(-LEFT:GPIOL_54_CDI11)
A13: IC8.44(1A2) U$1.142(-RIGHT:GPIOL_66_CDI12)
A14: IC8.46(1A1) U$1.141(-RIGHT:GPIOL_65)
A15: IC8.47(1A0) U$1.140(-RIGHT:GPIOL_67_CDI13)
AUDIO: DBG_EXT.5 U$2.E5(E5:AUDIO)
CBSEL0: R23.2 U$1.137(-RIGHT:GPIOL_70_CBSEL0)
CBSEL1: R24.2 U$1.138(-RIGHT:GPIOL_69_CBSEL1)
CBUS0: U$1.78(-TOP:GPIOR_151_CBUS0) ; also sheet 3
CBUS1: U$1.79(-TOP:GPIOR_150_CBUS1) ; also sheet 3
CBUS2: U$1.80(-TOP:GPIOR_149_CBUS2) ; also sheet 3
CDONE: R30.1 ; also sheet 3
CLK: IC7.44(1A2) U$1.110(-RIGHT:GPIOR_87_CDI29)
CLK25: U$1.75(-TOP:GPIOR_157_PLLIN) ; also sheet 2
D0: IC7.32(2A3) U$1.123(-RIGHT:GPIOR_77_PLLIN1)
D1: IC7.30(2A4) U$1.124(-RIGHT:GPIOR_76_PLLIN0)
D2: IC7.29(2A5) U$1.131(-RIGHT:GPIOL_75_PLLIN1)
D3: IC7.33(2A2) U$1.119(-RIGHT:GPIOR_78_EXTFB0_CDI31)
D4: IC7.26(2A7) U$1.134(-RIGHT:GPIOL_73_EXTFB1_CDI15)
D5: IC7.27(2A6) U$1.132(-RIGHT:GPIOL_74_PLLIN0)
D6: IC7.35(2A1) U$1.118(-RIGHT:GPIOR_79_EXTFB1_CDI30)
D7: IC7.36(2A0) U$1.117(-RIGHT:GPIOR_80)
DIR_A: IC8.1(1DIR) IC8.24(2DIR) R10.2 U$1.139(-RIGHT:GPIOL_68)
DIR_D: IC7.24(2DIR) R11.2 U$1.135(-RIGHT:GPIOL_72_EXTFB0_CDI14)
DIR_EXTSEL: IC10.5(DIR) R17.1 U$1.106(-TOP:GPIOR_94_CDI27)
DIR_HALT: IC1.5(DIR) R13.2 U$1.97(-TOP:GPIOR_122_CLK13_CDI21)
DIR_IN: IC7.1(1DIR) R12.2 U$1.102(-TOP:GPIOR_105_CDI24)
DIR_IRQ: IC11.5(DIR) R18.1 U$1.99(-TOP:GPIOR_116_CTRL15)
DIR_MPD: IC9.5(DIR) R19.1 U$1.92(-TOP:GPIOR_125_CLK10)
DIR_REF: IC6.5(DIR) R15.2 U$1.89(-TOP:GPIOR_129_CTRL10)
DIR_RST: IC5.5(DIR) R14.2 U$1.101(-TOP:GPIOR_112_CDI23)
DIR_RW: IC4.5(DIR) R16.2 U$1.113(-RIGHT:GPIOR_84)
GND: C4.2 C5.2 C7.2 C8.2 C9.2 C10.2 C11.2 C12.2 C13.2 C14.2 C15.2 C16.2 C17.2 C18.2 C43.2 C44.2 C45.2 C46.2 C47.2 C48.2 C49.2 C50.2 CBSEL0.3 CBSEL1.3 DBG_CART.28 DBG_EXT.2 DBG_XIO1.10 IC1.2(GND) IC4.2(GND) IC5.2(GND) IC6.2(GND) IC7.4(GND) IC7.10(GND) IC7.12(1B7) IC7.15(GND) IC7.21(GND) IC7.25(!2OE) IC7.28(GND) IC7.34(GND) IC7.37(1A7) IC7.39(GND) IC7.45(GND) IC7.48(!1OE) IC8.4(GND) IC8.10(GND) IC8.15(GND) IC8.21(GND) IC8.25(!2OE) IC8.28(GND) IC8.34(GND) IC8.39(GND) IC8.45(GND) IC8.48(!1OE) IC9.2(GND) IC10.2(GND) IC11.2(GND) IC12.2(E) R10.1 R11.1 R12.1 R13.1 R14.1 R15.1 R16.1 U$2.B(B:GND) U$2.E:H(EH:GND) ; also sheet 1,2,3
N$1: CBSEL0.2 R23.1
N$3: CBSEL1.2 R24.1
N$5: IC12.1(B) R30.2
N$6: DONE.- IC12.3(C)
N$7: DONE.+ R29.2
N$9: R31.2 STATUS.+
R/!W!: IC4.3(A) U$1.111(-RIGHT:GPIOR_85)
RD4: IC7.38(1A6) U$1.116(-RIGHT:GPIOR_81_MREFCLK)
RD5: IC7.43(1A3) U$1.112(-RIGHT:GPIOR_86)
RSRVD: DBG_EXT.14 U$2.E:A(EA:RSRVD)
SPI_D2: U$1.20(-LEFT:GPIOL_12_CDI2) ; also sheet 2
SPI_D3: U$1.19(-LEFT:GPIOL_13_CDI3) ; also sheet 2,3
XIO_BOX_CLK: DBG_XIO0.9 ; also sheet 1
XIO_BOX_CTS: DBG_XIO1.9 ; also sheet 1
XIO_BOX_RTS: DBG_XIO1.1 ; also sheet 1
XIO_D0: DBG_XIO0.1 U$1.84(-TOP:GPIOR_135_CDI17) ; also sheet 1
XIO_D1: DBG_XIO0.7 ; also sheet 1
XIO_D2: DBG_XIO0.6 U$1.81(-TOP:GPIOR_139) ; also sheet 1
XIO_D3: DBG_XIO0.5 U$1.77(-TOP:GPIOR_154) ; also sheet 1
XIO_D4: DBG_XIO1.8 ; also sheet 1
XIO_D5: DBG_XIO1.6 ; also sheet 1
XIO_D6: DBG_XIO1.2 ; also sheet 1
XIO_D7: DBG_XIO1.4 ; also sheet 1
XIO_HOST_CLK: DBG_XIO1.3 ; also sheet 1
XIO_HOST_CTS: DBG_XIO0.4 U$1.83(-TOP:GPIOR_136_CDI16) ; also sheet 1
XIO_HOST_RTS: DBG_XIO0.2 U$1.86(-TOP:GPIOR_133_CDI18) ; also sheet 1
XIO_SHLD1: DBG_XIO0.3 U$1.82(-TOP:GPIOR_138) ; also sheet 1
XIO_SHLD2: DBG_XIO0.10 ; also sheet 1
XIO_SHLD3: DBG_XIO0.8 U$1.76(-TOP:GPIOR_155) ; also sheet 1
XIO_SHLD4: DBG_XIO1.5 ; also sheet 1
XIO_SHLD5: DBG_XIO1.7 ; also sheet 1

### Buses
A8_BUS:A8_A[0..7],A8_A8,A8_A[9..15],!A8_CCTL!,!A8_CLK!,A8_D[0..1],!A8_D1XX!,A8_D[2..7],!A8_EXTSEL!,!A8_HALT!,!A8_IRQ!,!A8_MPD!,A8_RD4,A8_RD5,!A8_REF!,!A8_RESET!,!A8_RST!,A8_R/!W!,!A8_S4!,!A8_S5!
FPGA+BUS:A[0..15],!CCTL!,CLK,D[0..7],!D1XX!,DIR_A,DIR_D,DIR_EXTSEL,DIR_HALT,DIR_IN,DIR_IRQ,DIR_MPD,DIR_REF,DIR_RST,DIR_RW,!EXTSEL!,!HALT!,!IRQ!,!MPD!,RD4,RD5,!REF!,!RESET!,R/!W!,!S4!,!S5!
XIO:XIO_BOX_CLK,XIO_BOX_CTS,XIO_BOX_RTS,XIO_D[0..7],XIO_HOST_CLK,XIO_HOST_CTS,XIO_HOST_RTS,XIO_SHLD[1..5]

### Notes on the sheet
- DIR_*, SPI, JTAG pull resistors
  USB-C connector
  TTAG / JTAG / SPI
  CDONE, CRESET, Leds, STATUS
  Use the Efinix transistor on CDONE
- Atari IO

## Library data of the parts
C1 C22 C34 C52 = rcl:C-EU: CAPACITOR, European symbol; SPICEPREFIX: C; USE: CL05A106MP5NUNC
C4 C5 C7-C18 C21 C24 C26 C28 C30 C33 C36 C38 C40 C42-C51 C53 C54 = rcl:C-EU: CAPACITOR, European symbol; SPICEPREFIX: C; USE: GRM033R61A104ME15D
C6 C19 C23 C27 C31 C35 C39 C55 C56 = rcl:C-EU: CAPACITOR, European symbol; SPICEPREFIX: C; USE: CM03X5R105M10AH
C20 C25 C29 C32 C37 C41 = rcl:C-EU: CAPACITOR, European symbol; SPICEPREFIX: C; USE: GRM033R61C103KA12D
CBSEL0 CBSEL1 CBUS0 CBUS1 CBUS2 = pinhead:PINHD-1X3: PIN HEADER
DBG_CART = pinhead-2:PINHD-2X15: PIN HEADER
DBG_EXT = pinhead-2:PINHD-2X07: PIN HEADER
DBG_XIO0 DBG_XIO1 = pinhead:PINHD-2X5: PIN HEADER
DONE LD0 LD1 LD2 STATUS = Seeed-LED:SMD-LED-CLEAR-GREEN(0603): 304090043; MPN: 19-217-G7C-AN1P2-3T; USE: SML-E12M8WT86
FLASH = SparkFun:SPI_FLASH-X25XX: 8pin SPI Flash series x25xx. Works with devices like W25X32 and BR25L32; USE: W25Q32JVSSIQ
H1 H2 = holes:MOUNT-PAD-ROUND: MOUNTING PAD, round
IC1 IC4-IC6 IC9-IC11 = host:74LVC1T45GS,132: 74LVC1T45; 74LVCH1T45 - Dual supply translating transceiver; 3-state@en-us Source: Datasheet <https://assets.nexperia.com/documents/data-sheet/74LVC_LVCH1T45.pdf>; ARROW_PART_NUMBER: 74LVC1T45GS,132; ARROW_PRICE-STOCK: https://www.arrow.com/en/products/74lvc1t45gs132/nexperia?region=nac; DESCRIPTION: 74LVC1T45; 74LVCH1T45 - Dual supply translating transceiver; 3-state@en-us; HEIGHT: 0.35mm; MANUFACTURER_NAME: Nexperia; MANUFACTURER_PART_NUMBER: 74LVC1T45GS,132; MOUSER_PART_NUMBER: 771-74LVC1T45GS132; MOUSER_PRICE-STOCK: https://www.mouser.co.uk/ProductDetail/Nexperia/74LVC1T45GS132?qs=vbj%2FKoHZRAipTvFaVBBEqQ%3D%3D; USE: 74LVC1T45GS,132
IC2 = x-pi:NCP187AMT330TAG: LDO Voltage Regulators 1.2A 3.3V Active discharge Source: Datasheet <https://componentsearchengine.com/Datasheets/1/NCP187AMT330TAG.pdf>; ARROW_PART_NUMBER: NCP187AMT120TAG; ARROW_PRICE-STOCK: https://www.arrow.com/en/products/ncp187amt330tag/on-semiconductor; DESCRIPTION: LDO Voltage Regulators 1.2A 3.3V Active discharge; HEIGHT: 0.8mm; MANUFACTURER_NAME: ON Semiconductor; MANUFACTURER_PART_NUMBER: NCP187AMT330TAG; MOUSER_PART_NUMBER: 863-NCP187AMT330TAG; MOUSER_PRICE-STOCK: https://www.mouser.co.uk/ProductDetail/ON-Semiconductor/NCP187AMT330TAG?qs=%252B6g0mu59x7JOII%252BWk4iw4Q%3D%3D; USE: NCP187AMT120TAG
IC7 IC8 = samacsys:74ALVC164245DGG_11: 74ALVC164245 - 16-bit dual supply translating transceiver; 3-state@en-us Source: Datasheet <https://assets.nexperia.com/documents/data-sheet/74ALVC164245.pdf>; ARROW_PART_NUMBER: 74ALVC164245DGG:11; ARROW_PRICE-STOCK: https://www.arrow.com/en/products/74alvc164245dgg11/nexperia; DESCRIPTION: 74ALVC164245 - 16-bit dual supply translating transceiver; 3-state@en-us; HEIGHT: 1.2mm; MANUFACTURER_NAME: Nexperia; MANUFACTURER_PART_NUMBER: 74ALVC164245DGG:11; MOUSER_PART_NUMBER: 771-74ALVC164245; MOUSER_PRICE-STOCK: https://www.mouser.co.uk/ProductDetail/Nexperia/74ALVC164245DGG11?qs=odJ8N4Y39o4j0ykFPcnqaQ%3D%3D; USE: 74ALVC164245DGG:11
IC12 = host:MMBT3904T: Trans GP BJT NPN 40V 0.2A 300mW 3-Pin SOT-523FL T/R Source: Datasheet <https://componentsearchengine.com/Datasheets/2/MMBT3904T.pdf>; ARROW_PART_NUMBER: MMBT3904T; ARROW_PRICE-STOCK: https://www.arrow.com/en/products/mmbt3904t/on-semiconductor; DESCRIPTION: Trans GP BJT NPN 40V 0.2A 300mW 3-Pin SOT-523FL T/R; HEIGHT: 0.78mm; MANUFACTURER_NAME: ON Semiconductor; MANUFACTURER_PART_NUMBER: MMBT3904T; MOUSER_PART_NUMBER: 512-MMBT3904T; MOUSER_PRICE-STOCK: https://www.mouser.co.uk/ProductDetail/ON-Semiconductor-Fairchild/MMBT3904T?qs=ZAjGDd5n2aEhPNEac8fMzw%3D%3D; USE: MMBT3904T-7-F
IC13 = host:NCP186BMX330TAG: LDO Voltage Regulators FAST TRANSIENT RESPO Source: Datasheet <http://www.onsemi.com/pub/Collateral/NCP186-D.PDF>; ARROW_PART_NUMBER: NCP186BMX330TAG; ARROW_PRICE-STOCK: https://www.arrow.com/en/products/ncp186bmx330tag/on-semiconductor?region=nac; DESCRIPTION: LDO Voltage Regulators FAST TRANSIENT RESPO; HEIGHT: mm; MANUFACTURER_NAME: ON Semiconductor; MANUFACTURER_PART_NUMBER: NCP186BMX330TAG; MOUSER_PART_NUMBER: 863-NCP186BMX330TAG; MOUSER_PRICE-STOCK: https://www.mouser.co.uk/ProductDetail/onsemi/NCP186BMX330TAG?qs=tCMd4XlZ%2FiDuLBXmI4EY0w%3D%3D; USE: NCP186BMX330TAG
R1-R28 = rcl:R-EU_: RESISTOR, European symbol; SPICEPREFIX: R; USE: CR0201-JW-103GLF
R29 R31 R33-R35 = rcl:R-EU_: RESISTOR, European symbol; SPICEPREFIX: R; USE: WR02X221 JAL
R30 = rcl:R-EU_: RESISTOR, European symbol; SPICEPREFIX: R; USE: PFR03S-104-JNH
R32 = rcl:R-EU_: RESISTOR, European symbol; SPICEPREFIX: R; USE: RC0201FR-0712KL
RESET = SparkFun:TAC_SWITCH: Momentary Switch Button commonly used for reset or general input. Spark Fun Electronics SKU : COM-00097; DNF: 1; USE: B3F-1005
SPV = x-pi:MIC803-30D2VM3-TR: Supervisory Circuits 3-Pin Microprocessor Supervisor Circuit w/ Open-Drain Reset Output Source: Datasheet <http://ww1.microchip.com/downloads/en/DeviceDoc/mic803.pdf>; ARROW_PART_NUMBER: MIC803-30D2VM3-TR; ARROW_PRICE-STOCK: https://www.arrow.com/en/products/mic803-30d2vm3-tr/microchip-technology; DESCRIPTION: Supervisory Circuits 3-Pin Microprocessor Supervisor Circuit w/ Open-Drain Reset Output; HEIGHT: 1.11mm; MANUFACTURER_NAME: Microchip; MANUFACTURER_PART_NUMBER: MIC803-30D2VM3-TR; MOUSER_PART_NUMBER: 998-MIC803-30D2VM3TR; MOUSER_PRICE-STOCK: https://www.mouser.co.uk/ProductDetail/Microchip-Technology-Micrel/MIC803-30D2VM3-TR?qs=Y3Q3JoKAO1TJsIpIft4U2Q%3D%3D; USE: MIC803-30D2VC3-TR
TTAG = x-pi:TTAG_M: PIN HEADER
U$1 = sjg-efinix:T8; USE: T8Q144I4
U$2 = host:XE_PBI: Atari XE ECI/PBI port layout
UHDMI = host:10118241-001RLF: HDMI, Displayport & DVI Connectors MICRO HDMI RCPT SMT DIP+ SMT LEG TYPE D Source: Datasheet <https://componentsearchengine.com/Datasheets/1/10118241-001RLF.pdf>; ARROW_PART_NUMBER: 10118241-001RLF; ARROW_PRICE-STOCK: https://www.arrow.com/en/products/10118241-001rlf/amphenol-fci?region=nac; DESCRIPTION: HDMI, Displayport & DVI Connectors MICRO HDMI RCPT SMT DIP+ SMT LEG TYPE D; HEIGHT: 2.9mm; MANUFACTURER_NAME: Amphenol; MANUFACTURER_PART_NUMBER: 10118241-001RLF; MOUSER_PART_NUMBER: 649-10118241-001RLF; MOUSER_PRICE-STOCK: https://www.mouser.co.uk/ProductDetail/Amphenol-FCI/10118241-001RLF?qs=Ywefl8B65e6AsX2jvbcj2Q%3D%3D; USE: 10118241-001RLF
V3.3 V12 = pinhead:PINHD-1X2: PIN HEADER
Y1 = x-pi:DSC6001J: MEMS CMOS OSC SMD Source: Datasheet <https://ww1.microchip.com/downloads/en/DeviceDoc/DSC60xxB-Ultra-Small-Ultra-Low-Power-MEMS-Oscillato>; DESCRIPTION: MEMS CMOS OSC SMD; HEIGHT: 0.89mm; MANUFACTURER_NAME: Microchip; MANUFACTURER_PART_NUMBER: DSC6001JE2B-024.0000; MOUSER_PART_NUMBER: 579-6001JE2B024.0000; MOUSER_PRICE-STOCK: https://www.mouser.co.uk/ProductDetail/Microchip-Technology/DSC6001JE2B-0240000?qs=xZ%2FP%252Ba9zWqbhSgsqNWWTew%3D%3D; USE: DSC6001JI1A-050.0000

## Net classes
1 +5v: width 0.305 mm
2 +1.2v: width 0.305 mm